# EAGLE schematic motherboard_v1_21 (EAGLE 7.5.0)
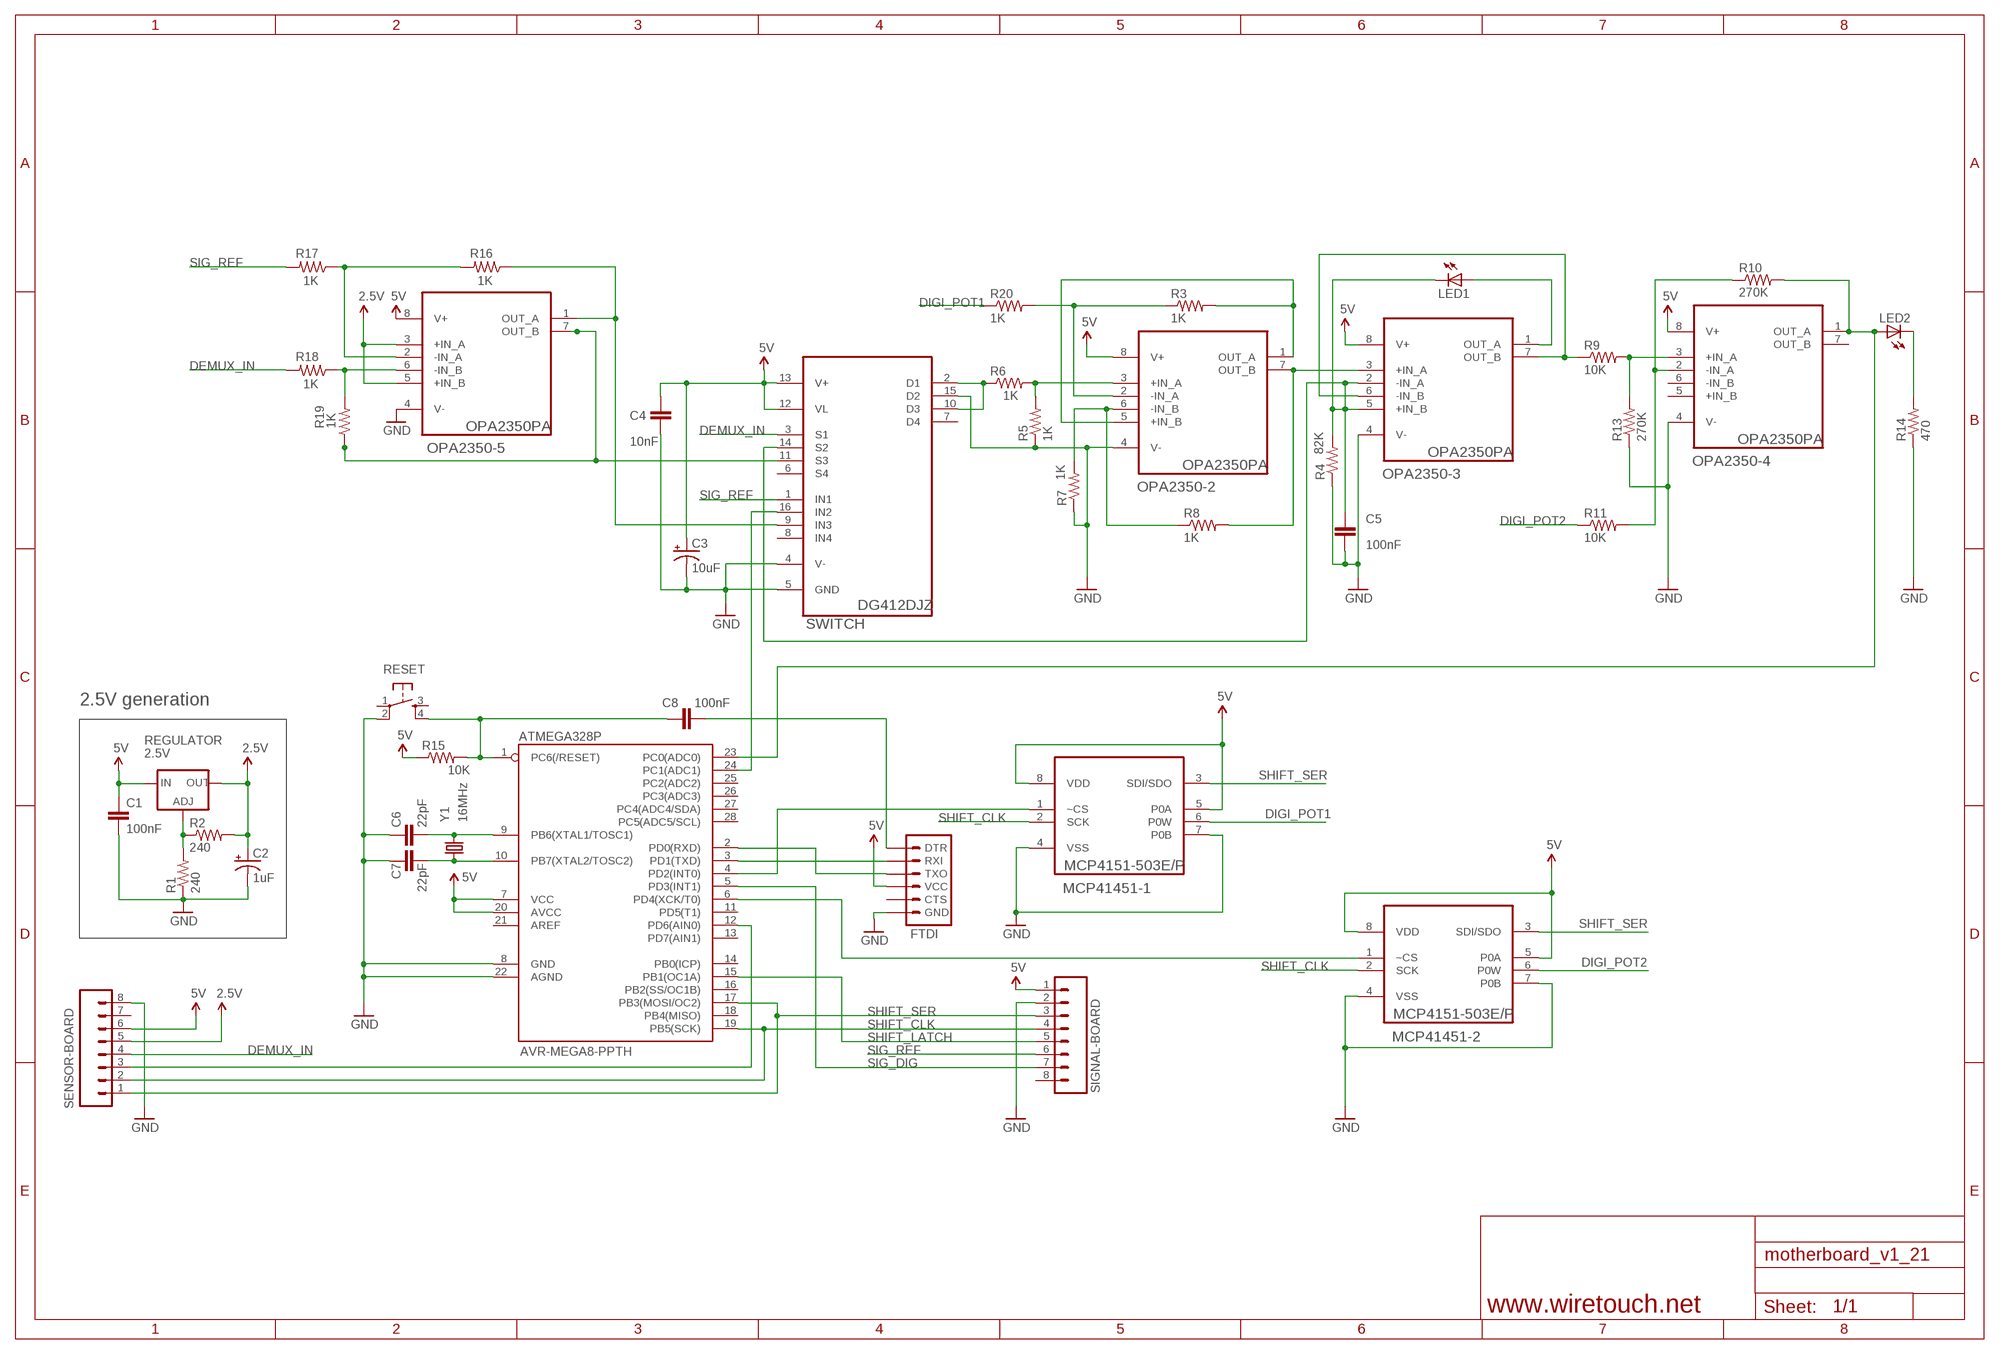
[diagram p0: schematic, sheet 1]

## Parts
ATMEGA328P  AVR-MEGA8-PPTH  [DIL28-3]
C1  100nF  CAPPTH  [CAP-PTH-SMALL]
C2  1uF  CAP_POLPTH2  [CPOL-RADIAL-10UF-25V]
C3  10uF  CAP_POLPTH2  [CPOL-RADIAL-10UF-25V]
C4  10nF  CAPPTH  [CAP-PTH-SMALL]
C5  100nF  CAPPTH  [CAP-PTH-SMALL]
C6  22pF  CAPPTH2  [CAP-PTH-SMALL2]
C7  22pF  CAPPTH2  [CAP-PTH-SMALL2]
C8  100nF  CAPPTH2  [CAP-PTH-SMALL2]
FTDI  ARDUINO_SERIAL_PROGRAMLONGPADS  [1X06_LONGPADS]
LED1  LED3MM  [LED3MM]
LED2  LED5MM  [LED5MM]
MCP41451-1  MCP4151-503E/P  [DIP254P762X533-8]
MCP41451-2  MCP4151-503E/P  [DIP254P762X533-8]
OPA2350-2  OPA2350PA  [DIP254P762X508-8]
OPA2350-3  OPA2350PA  [DIP254P762X508-8]
OPA2350-4  OPA2350PA  [DIP254P762X508-8]
OPA2350-5  OPA2350PA  [DIP254P762X508-8]
R1  240  RESISTORAXIAL-0.3  [AXIAL-0.3]
R2  240  RESISTORAXIAL-0.3  [AXIAL-0.3]
R3  1K  RESISTORAXIAL-0.3  [AXIAL-0.3]
R4  82K  RESISTORAXIAL-0.3  [AXIAL-0.3]
R5  1K  RESISTORAXIAL-0.3  [AXIAL-0.3]
R6  1K  RESISTORAXIAL-0.3  [AXIAL-0.3]
R7  1K  RESISTORAXIAL-0.3  [AXIAL-0.3]
R8  1K  RESISTORAXIAL-0.3  [AXIAL-0.3]
R9  10K  RESISTORAXIAL-0.3  [AXIAL-0.3]
R10  270K  RESISTORAXIAL-0.3  [AXIAL-0.3]
R11  10K  RESISTORAXIAL-0.3  [AXIAL-0.3]
R13  270K  RESISTORAXIAL-0.3  [AXIAL-0.3]
R14  470  RESISTORAXIAL-0.3  [AXIAL-0.3]
R15  10K  RESISTORAXIAL-0.3  [AXIAL-0.3]
R16  1K  RESISTORAXIAL-0.3  [AXIAL-0.3]
R17  1K  RESISTORAXIAL-0.3  [AXIAL-0.3]
R18  1K  RESISTORAXIAL-0.3  [AXIAL-0.3]
R19  1K  RESISTORAXIAL-0.3  [AXIAL-0.3]
R20  1K  RESISTORAXIAL-0.3  [AXIAL-0.3]
REGULATOR  2.5V  V_REG_317SINK  [TO220-ADJ]
RESET  TAC_SWITCHPTH  [TACTILE-PTH]
SENSOR-BOARD  M08LONGPADS  [1X08_LONGPADS]
SIGNAL-BOARD  M08LONGPADS  [1X08_LONGPADS]
SWITCH  DG412DJZ  [DIP254P762X533-16]
Y1  16MHz  CRYSTALHC49US  [HC49US]

## Nets
2.8V: C2.1(+) OPA2350-5.3(+IN_A) OPA2350-5.5(+IN_B) R2.P$2 REGULATOR.OUT SENSOR-BOARD.5 ; supply symbol labelled 2.5V
5V: ATMEGA328P.7(VCC) ATMEGA328P.20(AVCC) C1.1 C3.1(+) C4.1 FTDI.4(VCC) MCP41451-1.5(P0A) MCP41451-1.8(VDD) MCP41451-2.5(P0A) MCP41451-2.8(VDD) OPA2350-2.8(V+) OPA2350-3.8(V+) OPA2350-4.8(V+) OPA2350-5.8(V+) R15.P$1 REGULATOR.IN SENSOR-BOARD.6 SIGNAL-BOARD.1 SWITCH.12(VL) SWITCH.13(V+)
DEMUX_IN: R18.P$2 SENSOR-BOARD.4 SWITCH.3(S1)
DIGI_POT1: MCP41451-1.6(P0W) R20.P$1
DIGI_POT2: MCP41451-2.6(P0W) R11.P$1
GND: ATMEGA328P.8(GND) ATMEGA328P.22(AGND) C1.2 C2.2(-) C3.2(-) C4.2 C5.2 C6.1 C7.1 FTDI.6(GND) MCP41451-1.4(VSS) MCP41451-1.7(P0B) MCP41451-2.4(VSS) MCP41451-2.7(P0B) OPA2350-2.4(V-) OPA2350-3.4(V-) OPA2350-4.4(V-) OPA2350-5.4(V-) R1.P$1 R4.P$1 R5.P$1 R7.P$1 R13.P$1 R14.P$1 RESET.2 SENSOR-BOARD.8 SIGNAL-BOARD.2 SWITCH.4(V-) SWITCH.5(GND) SWITCH.15(D2)
N$1: R6.P$1 SWITCH.2(D1) SWITCH.10(D3)
N$2: OPA2350-2.1(OUT_A) OPA2350-2.5(+IN_B) R3.P$2
N$3: R1.P$2 R2.P$1 REGULATOR.ADJ
N$4: OPA2350-2.2(-IN_A) R3.P$1 R20.P$2
N$5: OPA2350-2.3(+IN_A) R5.P$2 R6.P$2
N$6: OPA2350-2.6(-IN_B) R7.P$2 R8.P$1
N$7: OPA2350-4.2(-IN_A) R10.P$1 R11.P$2
N$8: ATMEGA328P.24(PC1(ADC1)) SWITCH.16(IN2)
N$9: LED1.A OPA2350-3.1(OUT_A)
N$10: OPA2350-2.7(OUT_B) OPA2350-3.3(+IN_A) R8.P$2
N$11: C5.1 LED1.K(C) OPA2350-3.2(-IN_A) OPA2350-3.5(+IN_B) R4.P$2 SWITCH.14(S2)
N$12: OPA2350-3.6(-IN_B) OPA2350-3.7(OUT_B) R9.P$1
N$13: OPA2350-4.3(+IN_A) R9.P$2 R13.P$2
N$14: ATMEGA328P.23(PC0(ADC0)) LED2.A OPA2350-4.1(OUT_A) R10.P$2
N$15: ATMEGA328P.6(PD4(XCK/T0)) MCP41451-2.1(~CS)
N$16: OPA2350-5.6(-IN_B) R18.P$1 R19.P$2
N$17: LED2.K(C) R14.P$2
N$18: ATMEGA328P.9(PB6(XTAL1/TOSC1)) C6.2 Y1.2
N$19: ATMEGA328P.10(PB7(XTAL2/TOSC2)) C7.2 Y1.1
N$20: ATMEGA328P.1(PC6(/RESET)) C8.1 R15.P$2 RESET.4
N$21: ATMEGA328P.3(PD1(TXD)) FTDI.2(RXI)
N$22: ATMEGA328P.2(PD0(RXD)) FTDI.3(TXO)
N$23: C8.2 FTDI.1(DTR)
N$24: OPA2350-5.1(OUT_A) R16.P$1 SWITCH.9(IN3)
N$25: OPA2350-5.2(-IN_A) R16.P$2 R17.P$1
N$27: OPA2350-5.7(OUT_B) R19.P$1 SWITCH.11(S3)
N$28: ATMEGA328P.4(PD2(INT0)) MCP41451-1.1(~CS)
N$127: ATMEGA328P.12(PD6(AIN0)) SENSOR-BOARD.3
SHIFT_CLK: ATMEGA328P.19(PB5(SCK)) MCP41451-1.2(SCK) MCP41451-2.2(SCK) SENSOR-BOARD.2 SIGNAL-BOARD.4
SHIFT_LATCH: ATMEGA328P.15(PB1(OC1A)) SIGNAL-BOARD.5
SHIFT_SER: ATMEGA328P.17(PB3(MOSI/OC2)) MCP41451-1.3(SDI/SDO) MCP41451-2.3(SDI/SDO) SENSOR-BOARD.1 SIGNAL-BOARD.3
SIG_DIG: ATMEGA328P.5(PD3(INT1)) SIGNAL-BOARD.7
SIG_REF: R17.P$2 SIGNAL-BOARD.6 SWITCH.1(IN1)
Unconnected: ATMEGA328P.11(PD5(T1)) ATMEGA328P.13(PD7(AIN1)) ATMEGA328P.14(PB0(ICP)) ATMEGA328P.16(PB2(SS/OC1B)) ATMEGA328P.18(PB4(MISO)) ATMEGA328P.21(AREF) ATMEGA328P.25(PC2(ADC2)) ATMEGA328P.26(PC3(ADC3)) ATMEGA328P.27(PC4(ADC4/SDA)) ATMEGA328P.28(PC5(ADC5/SCL)) FTDI.5(CTS) OPA2350-4.5(+IN_B) OPA2350-4.6(-IN_B) OPA2350-4.7(OUT_B) RESET.1 RESET.3 SENSOR-BOARD.7 SIGNAL-BOARD.8 SWITCH.6(S4) SWITCH.7(D4) SWITCH.8(IN4)

## Notes on the sheet
- 2.5V generation
- www.wiretouch.net

## Library data of the parts
ATMEGA328P = SparkFun-DigitalIC:AVR-MEGA8-P: MICROCONTROLLER 8 Kbytes FLASH 1 kbytes SRAM 512 bytes EEPROM USART 4-channel 10 bit ADC 2-channel 8 bit ADC
C1 C4-C8 = SparkFun-Passives:CAP: Capacitor Standard 0603 ceramic capacitor, and 0.1" leaded capacitor.
C2 C3 = SparkFun-Passives:CAP_POL: Capacitor Polarized These are standard SMD and PTH capacitors. Normally 10uF, 47uF, and 100uF in electrolytic and tantalum varieties. Always verify the external diameter of the through hole cap, it varies with capacity, voltage, and manufacturer. The EIA devices should be standard.
FTDI = SparkFun-Connectors:ARDUINO_SERIAL_PROGRAM: FTDI connector footprints
LED1 LED2 = SparkFun-LED:LED: LEDs Standard schematic elements and footprints for 5mm, 3mm, 1206, and 0603 sized LEDs. 5mm - Spark Fun Electronics SKU : COM-00529 (and others)
MCP41451-1 MCP41451-2 = gkaindl:MCP4151-503E/P: Digital POT; MPN: MCP4151-503E/P; OC_FARNELL: 1840819; OC_NEWARK: 77M2694; PACKAGE: DIP-8; SUPPLIER: Microchip
OPA2350-2-OPA2350-5 = gkaindl:OPA2350PA: OPERATIONAL AMPLIFIER; MPN: OPA2350PA; OC_FARNELL: 4353316; OC_NEWARK: 75C4730; PACKAGE: PDIP; SUPPLIER: Texas Instruments
R1-R11 R13-R20 = SparkFun-Passives:RESISTOR: Resistor Basic schematic elements and footprints for 0603, 1206, and PTH resistors.
REGULATOR = SparkFun-PowerIC:V_REG_317: Voltage Regulator Standard LM317 adjustable voltage regulator. AOI (Adjust Output Input). Google 'LM317 Calculator' for easy to use app to get the two resistor values needed. 240/720 for 5V output. 240/390 for 3.3V output. Spark Fun Electronics SKU : COM-00527
RESET = SparkFun-Electromechanical:TAC_SWITCH: Momentary Switch Button commonly used for reset or general input. Spark Fun Electronics SKU : COM-00097 SMT- SWCH-08247
SENSOR-BOARD SIGNAL-BOARD = SparkFun-Connectors:M08: Header 8 Standard 8-pin 0.1" header. Use with straight break away headers (SKU : PRT-00116), right angle break away headers (PRT-00553), swiss pins (PRT-00743), machine pins (PRT-00117), and female headers (PRT-00115).
SWITCH = gkaindl:DG412DJZ: CMOS Analog switches; MPN: DG412DJZ; OC_FARNELL: 1561997; OC_NEWARK: 79K6183; PACKAGE: PDIP-16; SUPPLIER: INTERSIL
Y1 = SparkFun-FreqCtrl:CRYSTAL: Various standard crystals. Proven footprints. Spark Fun Electronics SKU : COM-00534